# Altium project levitate_watches_pcb.PrjPcb
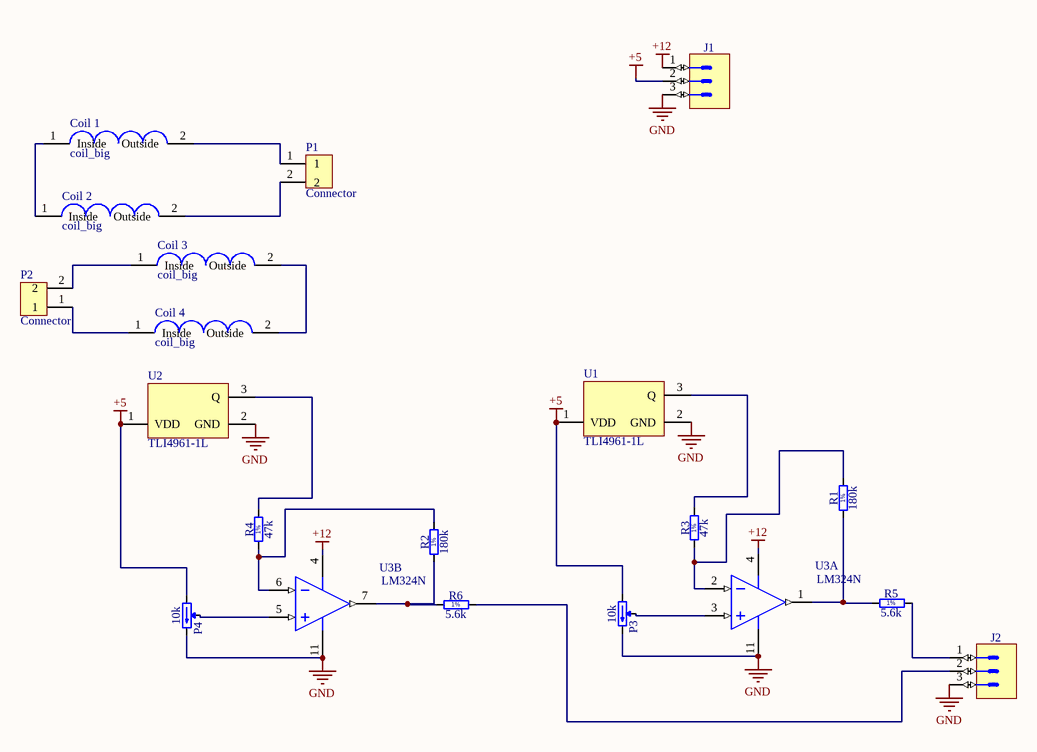
[diagram p0: Sheet1.SchDoc]
1 sheet, 19 parts. Net scope: global (net labels, ports and power ports of the same name join across sheets).
Board file: PCB1.PcbDoc

## Sheet Sheet1.SchDoc
size A4

### Parts
Coil_1  coil_big  [coil_big_test]
Coil_2  coil_big  [coil_big_test]
Coil_3  coil_big  [coil_big_test]
Coil_4  coil_big  [coil_big_test]
J1  KK®  [MOLEX_22-27-2031]  (value not drawn)
J2  KK®  [MOLEX_22-27-2031]  (value not drawn)
P1  Connector  [350-021-14]
P2  Connector  [350-021-14]
P3  10k  [TRIM_BOURNS_3296Y]
P4  10k  [TRIM_BOURNS_3296Y]
R1  180k  [RESC1608X55N]
R2  180k  [RESC1608X55N]
R3  47k  [RESC1608X55N]
R4  47k  [RESC1608X55N]
R5  5.6k  [RESC1608X55N]
R6  5.6k  [RESC1608X55N]
U1  TLI4961-1L  [INF-PG-SSO-3-2_V]
U2  TLI4961-1L  [INF-PG-SSO-3-2_V]
U3  LM324N  [N14A]  (parts A,B of 4)

### Nets
+5: J1.2 P3.1(CCW) P4.1(CCW) U1.1(VDD) U2.1(VDD)
+12: J1.1 U3.4(V+)
GND: J1.3 J2.3 P3.3(CW) P4.3(CW) U1.2(GND) U2.2(GND) U3.11(GND)
NetCoil_1_1: Coil_1.1(Inside) Coil_2.1(Inside)
NetCoil_1_2: Coil_1.2(Outside) P1.1
NetCoil_2_2: Coil_2.2(Outside) P1.2
NetCoil_3_1: Coil_3.1(Inside) P2.2
NetCoil_3_2: Coil_3.2(Outside) Coil_4.2(Outside)
NetCoil_4_1: Coil_4.1(Inside) P2.1
NetJ2_1: J2.1 R5.2
NetJ2_2: J2.2 R6.2
NetP3_2: P3.2(W) U3.3(IN1+)
NetP4_2: P4.2(W) U3.5(IN2+)
NetR1_1: R1.1 R5.1 U3.1(OUT1)
NetR1_2: R1.2 R3.1 U3.2(IN1-)
NetR2_1: R2.1 R6.1 U3.7(OUT2)
NetR2_2: R2.2 R4.1 U3.6(IN2-)
NetR3_2: R3.2 U1.3(Q)
NetR4_2: R4.2 U2.3(Q)

### Notes on the sheet
- (in symbol R0603_100K_1%_0.1W_100PPM) 1%

### Library data of the parts
J1 J2 = MOLEX_22-27-2031: Connector 3 Male; Part Description: 2.54mm (.100") Pitch KK® Wire-to-Board Header, Vertical, with Friction Lock, 3 Circuits, Tin (Sn) Plating; Manufacturer: MOLEX; PressFit: No; Part Number: MOLEX_22-27-2031; Component Kind: Standard; Component Type: Standard; Pin Count: 3; Family: KK®; Mounted: Yes; Socket: No; SMD: No; Sense: No; Status: None; Manufacturer Part Number: 22-27-2031; ComponentHeight: 11.7mm; HelpURL: \\cern.ch\dfs\Applications\Altium\Datasheets\MOLEX_22-27-2031.pdf; Author: CERN DEM JLC; CreateDate: 04.12.2008; LatestRevisionDate: 04.12.2008
P1 P2 = 350-021-14
P3 P4 = TRIM_25T_10R_BOURNS_3296Y-1-100LF: Trimming Potentiometer; Part Description: 25 Turn Trimming Potentiometer (Top Adjustement); Manufacturer: BOURNS; Value: 10; Power: 0.5W; TC: ±100ppm/°C; Tolerance: ±10%; PressFit: No; Part Number: TRIM_25T_10R_BOURNS_3296Y-1-100LF; Component Kind: Standard; Component Type: Standard; Pin Count: 3; Manufacturer Part Number: 3296Y-1-100LF; Case: 3296Y; Mounted: Yes; Socket: No; SMD: No; Sense: No; ComponentHeight: 11.55mm; HelpURL: \\cern.ch\dfs\Applications\Altium\Datasheets\TRIM_BOURNS_3296Y.pdf; Author: CERN DEM JLC; CreateDate: 23.03.2015; LatestRevisionDate: 23.03.2015
R1-R6 = R0603_100K_1%_0.1W_100PPM: Resistor - 1%; Part Description: General Purpose Thick Film Chip Resistor; Manufacturer: GENERIC; Manufacturer1 Part Number: NRC06F1003TRF; Value: 100k; Power: 0.1W; TC: ±100ppm/°C; PressFit: No; Part Number: R0603_100K_1%_0.1W_100PPM; Component Kind: Standard; Component Type: Standard; Pin Count: 2; Status: Preferred; Tolerance: ±1%; Manufacturer Part Number: R0603_100K_1%_0.1W_100PPM; Case: 0603; Mounted: Yes; Sense: No; Socket: No; SMD: Yes; Manufacturer1 Example: NIC COMPONENT; Manufacturer1 ComponentHeight: 0.55mm; HelpURL: \\cern.ch\dfs\Applications\Altium\Datasheets\R0603_NIC_NRC.pdf; Author: CERN DEM JLC; CreateDate: 03.12.2007; LatestRevisionDate: 13.03.2008
U1 U2 = TLI4961-1L: Hall Effect Latch for Industrial Applications, -40 to 125 degC, PG-SSO-3-2, AMMO-PACK, Green; Manufacturer: Infineon; Bhyst (25degreesC) max: 4 mT; Bop (25degreesC) min: 2 mT; Brp (25degreesC) typ: -2 mT; Chopped Hall Technology: TRUE; Direction Detection: FALSE; Interface: open collector; DatasheetVersion: Rev. 1.1; PackageVersion: Jul-12; PackageReference: PG-SSO-3-2; PackageDescription: 3-Pin Plastic (Green) Single Small Outline, 4.16 x 3.29 mm Body, 1.27 mm Pitch; Green: TRUE; Packing: AMMO-PACK; Target Application: Industrial; Type: Latch; Mounting Technology: Through Hole; PartNumber: TLI4961-1L; ComponentLink1Description: Manufacturer URL; ComponentLink1URL: http://www.infineon.com/; ComponentLink2Description: Datasheet; ComponentLink2URL: http://www.infineon.com/dgdl/TLI4961-1_DS_Rev1.1.pdf?folderId=db3a30431ce5fb52011d29818c631b6b&fileId=db3a304338e5bb6e0138e7ae76540244; ComponentLink3Description: Package Specification; ComponentLink3URL: http://www.infineon.com/dgdl/TLE4961-1L_DS_Rev1.0.pdf?folderId=db3a30431ce5fb52011d29818c631b6b&fileId=db3a3043397219b6013977b435505444
U3 = LM324N: Low Power Quad Operational Amplifier, 14-pin MDIP; Manufacturer: National Semiconductor; PackageTopMarking: NSUZXYYTTE#*LM324N; PowerWise: N; CompType: Amplifiers; High-Reliability: Y; DatasheetVersion: Aug-2000; PackageVersion: revG, May-2006; PackageReference: N14A; PackageDescription: MDIP, .750 x .250 x.130in, 14 Lead, .100in Pitch; PartNumber: LM324N; RoHS: N; PinCount: 14; Code_JEDEC: MS-001-AA; ComponentLink1Description: Manufacturer URL; ComponentLink1URL: http://www.national.com/; ComponentLink2Description: LM324 Datasheet; ComponentLink2URL: http://www.national.com/ds/LM/LM324.pdf; ComponentLink3Description: LM324 Web Page; ComponentLink3URL: http://www.national.com/pf/LM/LM324.html; ComponentLink4Description: N14A Package Page; ComponentLink4URL: http://www.national.com/packaging/folders/n14a.html